# EAGLE schematic uc3906 charger 2 (EAGLE 6.4)
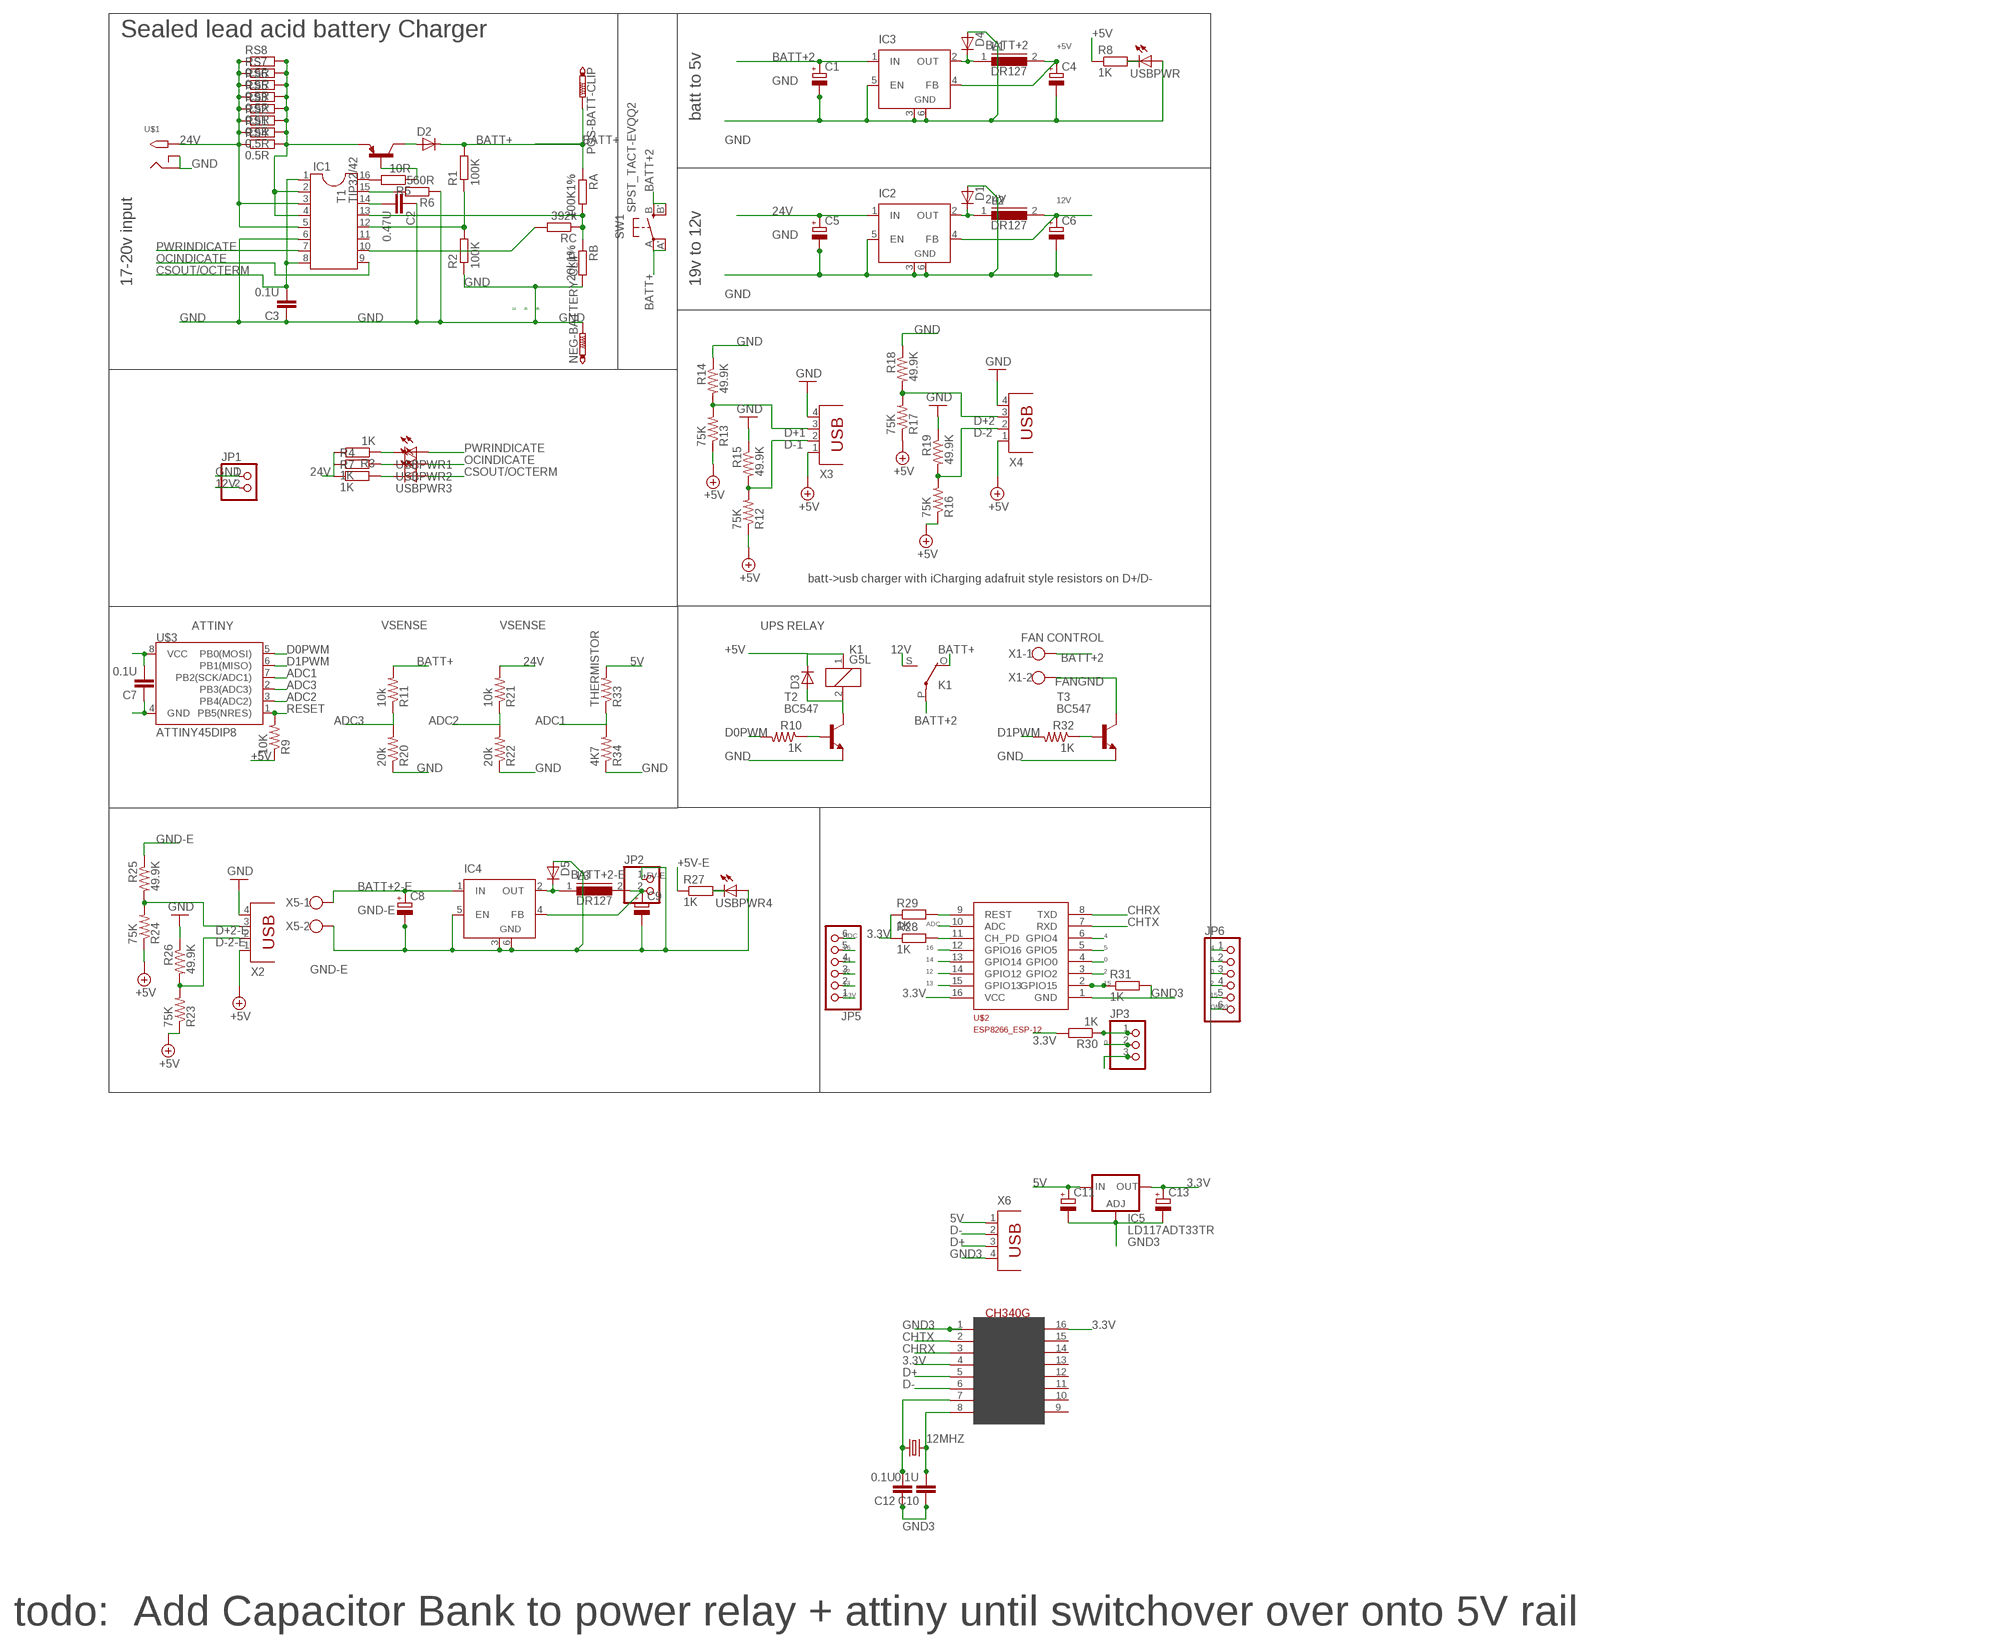
[diagram p0: schematic, sheet 1]

## Parts
12MHZ  CRYSTALHC49UP  [HC49UP]
C1  CPOL-EUE  [PANASONIC_E]
C2  0.47U  C-EUC1206  [C1206]
C3  0.1U  C-EUC1206  [C1206]
C4  CPOL-EUE  [PANASONIC_E]
C5  CPOL-EUE  [PANASONIC_E]
C6  CPOL-EUE  [PANASONIC_E]
C7  0.1U  C-EUC1206  [C1206]
C8  CPOL-EUE  [PANASONIC_E]
C9  CPOL-EUE  [PANASONIC_E]
C10  0.1U  C-EUC1206  [C1206]
C11  CPOL-EUE2.5-7  [E2,5-7]
C12  0.1U  C-EUC1206  [C1206]
C13  CPOL-EUE2.5-7  [E2,5-7]
D1  D-SOD-87  [SOD87]
D2  D-MLL-41  [MELF-MLL41]
D3  D-MLL-41  [MELF-MLL41]
D4  D-SOD-87  [SOD87]
D5  D-SOD-87  [SOD87]
IC1  DIL16  [DIL16]
IC2  LM2596S  [TO263-5]
IC3  LM2596S  [TO263-5]
IC4  LM2596S  [TO263-5]
IC5  LD117ADT33TR  [DPACK]
JP1  PINHD-1X2  [1X02]
JP2  PINHD-1X2  [1X02]
JP3  PINHD-1X3  [1X03]
JP5  PINHD-1X6  [1X06]
JP6  PINHD-1X6  [1X06]
K1  G5L  [G5LE]
L1  DR127  [DR127]
L2  DR127  [DR127]
L3  DR127  [DR127]
NEG-BATTERY-CLIP  PTR1PAD1-20Y  [P1-20Y]
POS-BATT-CLIP  PTR1PAD1-20Y  [P1-20Y]
R1  100K  R-EU_M1206  [M1206]
R2  100K  R-EU_M1206  [M1206]
R3  1K  R-EU_M1206  [M1206]
R4  1K  R-EU_M1206  [M1206]
R5  10R  R-EU_M1206  [M1206]
R6  560R  R-EU_M1206  [M1206]
R7  1K  R-EU_M1206  [M1206]
R8  1K  R-EU_M1206  [M1206]
R9  10K  R-US_M1206  [M1206]
R10  1K  R-US_M1206  [M1206]
R11  10k  R-US_M1206  [M1206]
R12  75K  R-US_M1206  [M1206]
R13  75K  R-US_M1206  [M1206]
R14  49.9K  R-US_M1206  [M1206]
R15  49.9K  R-US_M1206  [M1206]
R16  75K  R-US_M1206  [M1206]
R17  75K  R-US_M1206  [M1206]
R18  49.9K  R-US_M1206  [M1206]
R19  49.9K  R-US_M1206  [M1206]
R20  20k  R-US_M1206  [M1206]
R21  10k  R-US_M1206  [M1206]
R22  20k  R-US_M1206  [M1206]
R23  75K  R-US_M1206  [M1206]
R24  75K  R-US_M1206  [M1206]
R25  49.9K  R-US_M1206  [M1206]
R26  49.9K  R-US_M1206  [M1206]
R27  1K  R-EU_M1206  [M1206]
R28  1K  R-EU_M1206  [M1206]
R29  1K  R-EU_M1206  [M1206]
R30  1K  R-EU_M1206  [M1206]
R31  1K  R-EU_M1206  [M1206]
R32  1K  R-US_M1206  [M1206]
R33  THERMISTOR  R-US_M1206  [M1206]
R34  4K7  R-US_M1206  [M1206]
RA  100K1%  R-EU_M1206  [M1206]
RB  20k1%  R-EU_M1206  [M1206]
RC  392k  R-EU_M1206  [M1206]
RS1  0.5R  R-EU_R2512  [R2512]
RS2  0.5R  R-EU_R2512  [R2512]
RS3  0.5R  R-EU_R2512  [R2512]
RS4  0.5R  R-EU_R2512  [R2512]
RS5  0.5R  R-EU_R2512  [R2512]
RS6  0.5R  R-EU_R2512  [R2512]
RS7  0.5R  R-EU_R2512  [R2512]
RS8  0.5R  R-EU_R2512  [R2512]
SW1  SPST_TACT-EVQQ2  [EVQ-Q2]
T1  TIP32/42  TIP32C  [TO220]
T2  BC547  [TO92]
T3  BC547  [TO92]
U$1  2.1MMJACKTHM  [PJ-102A]
U$2  ESP8266_ESP-12  [ESP8266-ESP12]
U$3  ATTINY45DIP8  [DIP08]
U$4  CH340G  [SOIC16]
USBPWR  LED3MM  [LED3MM]
USBPWR1  LEDCHIPLED_1206  [CHIPLED_1206]
USBPWR2  LEDCHIPLED_1206  [CHIPLED_1206]
USBPWR3  LEDCHIPLED_1206  [CHIPLED_1206]
USBPWR4  LED3MM  [LED3MM]
X1  W237-102  [W237-102]
X2  PN87520  [PN87520]
X3  PN87520  [PN87520]
X4  PN87520  [PN87520]
X5  W237-102  [W237-102]
X6  PN61729  [PN61729]

## Nets
0: JP3.2 JP6.3 U$2.4(GPIO0)
2: JP6.4 U$2.3(GPIO2)
3.3V: C13.+ IC5.4(OUT) JP5.1 R28.1 R29.1 R30.2 U$2.16(VCC) U$4.4(V3) U$4.16(VCC)
4: JP6.1 U$2.6(GPIO4)
5: JP6.2 U$2.5(GPIO5)
5V: C11.+ IC5.3(IN) R33.2 X6.1
12: JP5.3 U$2.14(GPIO12)
12V [power]: C6.+ IC2.4(FB) JP1.2 K1.S(2:S) L2.2
13: JP5.2 U$2.15(GPIO13)
14: JP5.4 U$2.13(GPIO14)
15: JP6.5 R31.1 U$2.2(GPIO15)
16: JP5.5 U$2.12(GPIO16)
24V: C5.+ IC1.3 IC1.5 IC2.1(IN) R3.2 R4.1 R7.1 R21.2 RS1.1 RS2.1 RS3.1 RS4.1 RS5.1 RS6.1 RS7.1 RS8.1 U$1.TIP
+5V [power]: C4.+ C7.2 D3.1(C) IC3.4(FB) K1.1 L1.2 R8.1 R9.1 R12.1 R13.1 R16.1 R17.1 U$3.8(VCC) X3.1 X4.1
+5V-E [power]: C9.+ IC4.4(FB) JP2.2 L3.2 R23.1 R24.1 R27.1 X2.1 ; supply symbol labelled +5V
ADC: JP5.6 U$2.10(ADC)
ADC1: R33.1 R34.2 U$3.7(PB2(SCK/ADC1))
ADC2: R21.1 R22.2 U$3.3(PB4(ADC2))
ADC3: R11.1 R20.2 U$3.2(PB3(ADC3))
BATT+: D2.1(C) K1.O(2:O) POS-BATT-CLIP.TP R1.2 R11.2 RA.1 SW1.A'(P1) SW1.A(P)
BATT+2: C1.+ IC3.1(IN) K1.P(2:P) SW1.B'(S1) SW1.B(S) X1.1
BATT+2-E: C8.+ IC4.1(IN) X5.1
CHARGEENABLE: IC1.12 R1.1 R2.2
CHRX: U$2.8(TXD) U$4.3(RX)
CHTX: U$2.7(RXD) U$4.2(TX)
COMPENSATION: C2.2 IC1.14
CSOUT/OCTERM: C3.2 IC1.1 IC1.8 USBPWR3.A
D0PWM: R10.2 U$3.5(PB0(MOSI))
D1PWM: R32.2 U$3.6(PB1(MISO))
D+: U$4.5(D+) X6.3
D+1: R13.2 R14.2 X3.3
D+2: R17.2 R18.2 X4.3
D+2-E: R24.2 R25.2 X2.3
D-: U$4.6(D-) X6.2
D-1: R12.2 R15.2 X3.2
D-2: R16.2 R19.2 X4.2
D-2-E: R23.2 R26.2 X2.2
DRIVERSINK: IC1.16 R5.2
DRIVERSOURCE: IC1.15 R6.2
FANGND: T3.3(C) X1.2
GND: C1.- C2.1 C3.1 C4.- C5.- C6.- C7.1 D1.2(A) D4.2(A) IC1.6 IC2.3(GND) IC2.5(EN) IC2.6(GND) IC3.3(GND) IC3.5(EN) IC3.6(GND) JP1.1 NEG-BATTERY-CLIP.TP R2.1 R6.1 R14.1 R15.1 R18.1 R19.1 R20.1 R22.1 R34.1 RB.2 T2.1(E) T3.1(E) U$1.RING U$1.RING_SW U$3.4(GND) USBPWR.A X3.4 X4.4
GND3: C10.1 C11.- C12.1 C13.- IC5.1(ADJ) JP3.3 JP6.6 R31.2 U$2.1(GND) U$4.1(GND) X6.4
GND-E: C8.- C9.- D5.2(A) IC4.3(GND) IC4.5(EN) IC4.6(GND) JP2.1 R25.1 R26.1 USBPWR4.A X2.4 X5.2 ; supply symbol labelled GND
IOUT: IC1.2 IC1.4 RS1.2 RS2.2 RS3.2 RS4.2 RS5.2 RS6.2 RS7.2 RS8.2 T1.3(E)
N$2: R3.1 USBPWR1.C
N$3: D1.1(C) IC2.2(OUT) L2.1
N$4: D4.1(C) IC3.2(OUT) L1.1
N$5: R4.2 USBPWR2.C
N$6: R7.2 USBPWR3.C
N$7: R8.2 USBPWR.K(C)
N$8: D3.2(A) K1.2 T2.3(C)
N$9: D5.1(C) IC4.2(OUT) L3.1
N$10: R10.1 T2.2(B)
N$11: R27.2 USBPWR4.K(C)
N$12: 12MHZ.1 C12.2 U$4.7(XI)
N$13: 12MHZ.2 C10.2 U$4.8(XO)
N$14: R5.1 T1.1(B)
N$15: D2.2(A) T1.2(C)
N$16: R29.2 U$2.9(REST)
N$18: R28.2 U$2.11(CH_PD)
N$21: JP3.1 R30.1
N$36: R32.1 T3.2(B)
OCINDICATE: IC1.9 USBPWR2.A
PWRINDICATE: IC1.7 USBPWR1.A
RESET: R9.2 U$3.1(PB5(NRES))
STATELEVELCONTROL: IC1.10 RC.2
VSENSE: IC1.13 RA.2 RB.1 RC.1
Unconnected: IC1.11 U$4.9(CTS) U$4.10(DSR) U$4.11(RI) U$4.12(DCD) U$4.13(DTR) U$4.14(RTS) U$4.15(RS232)

## Notes on the sheet
- Sealed lead acid battery Charger
- batt to 5v
- 17-20v input | 19v to 12v
- J4 | J5 | J6
- batt->usb charger with iCharging adafruit style resistors on D+/D-
- ATTINY | UPS RELAY
- VSENSE | VSENSE | FAN CONTROL
- todo:  Add Capacitor Bank to power relay + attiny until switchover over onto 5V rail

## Library data of the parts
12MHZ = crystal:CRYSTAL: CRYSTAL; OC_FARNELL: unknown; OC_NEWARK: unknown
C1 C4-C6 C8 C9 = resistor:CPOL-EU: POLARIZED CAPACITOR, European symbol
C2 C3 C7 C10 C12 = rcl:C-EU: CAPACITOR, European symbol
C11 C13 = rcl:CPOL-EU: POLARIZED CAPACITOR, European symbol
D1-D5 = semicon-smd-ipc:D-: DIODE unfilled
IC1 = ic-package:DIL16: Dual In Line / Socket
IC2-IC4 = linear:LM2596S: STEP-DOWN VOLTAGE REGULATOR
IC5 = v-reg:LD117A?*: Low drop fixed and adjustable positive voltage regulators 1 A Source: http://www.st.com/stonline/products/literature/ds/7194/ld1117axx.pdf
JP1 JP2 = pinhead:PINHD-1X2: PIN HEADER
JP3 = pinhead:PINHD-1X3: PIN HEADER
JP5 JP6 = pinhead:PINHD-1X6: PIN HEADER
K1 = relay:G5L: RELAY 1 x switch, 10 A/120 V AC, 8 A/30 V ADC, Omron; OC_FARNELL: unknown; OC_NEWARK: unknown
L1-L3 = inductors:DR127: High Power Density, High Efficiency, Shielded Inductors Source: coiltronics_dr_series.pdf
NEG-BATTERY-CLIP POS-BATT-CLIP = testpad:PTR1: TEST PIN
R1-R8 R27-R31 RA RB RC = rcl:R-EU_: RESISTOR, European symbol
R9-R26 R32-R34 = adafruit:R-US_: RESISTOR, American symbol
RS1-RS8 = resistor:R-EU_: RESISTOR, European symbol
SW1 = adafruit:SPST_TACT: SMT 6mm switch, EVQQ2 series http://www.ladyada.net/library/eagle
T1 = transistor:TIP32: PNP Transistor Medium Power Linear Switching Applications Source: http://onsemi.com
T2 T3 = transistor:BC547: NPN TRANSISTOR
U$1 = adafruit:2.1MMJACK: 2.1mm x 5.5mm THM DC jack with internal switch. Digikey part #PJ-102A, 4UCON part #05537 2.1mm x 5.5mm SMT DC jack with internal switch. Digikey part #PJ-002A-SMT, 4UCON part #03267 By microbuilder.eu & adafruit.com
U$2 = ESP8266-ESP12:ESP8266_ESP-12: ESP8266 ESP-12 Discussion about pins here: http://www.esp8266.com/viewtopic.php?f=13&t=1429
U$3 = SparkFun:ATTINY45: Atmel ATTiny45
U$4 = usb-serial:CH340G
USBPWR USBPWR1-USBPWR4 = RepRapjr:LED: LED OSRAM: - CHIPLED LG R971, LG N971, LY N971, LG Q971, LY Q971, LO R971, LY R971 LH N974, LH R974 LS Q976, LO Q976, LY Q976 LO Q996 - Hyper CHIPLED LW Q18S LB Q993, LB Q99A, LB R99A - SideLED LS A670, LO A670, LY A670, LG A670, LP A670 LB A673, LV A673, LT A673, LW A673 LH A674 LY A675 LS A676, LA A676, LO A676, LY A676, LW A676 LS A679, LY A679, LG A679 - Hyper Micro SIDELED® LS Y876, LA Y876, LO Y876, LY Y876 LT Y87S - SmartLED LW L88C, LW L88S LB L89C, LB L89S, LG L890 LS L89K, LO L89K, LY L89K LS L896, LA L896, LO L896, LY L896 - TOPLED LS T670, LO T670, LY T670, LG T670, LP T670 LSG T670, LSP T670, LSY T670, LOP T670, LYG T670 LG T671, LOG T671, LSG T671 LB T673, LV T673, LT T673, LW T673 LH T674 LS T676, LA T676, LO T676, LY T676, LB T676, LH T676, LSB T676, LW T676 LB T67C, LV T67C, LT T67C, LS T67K, LO T67K, LY T67K, LW E67C LS E67B, LA E67B, LO E67B, LY E67B, LB E67C, LV E67C, LT E67C LW T67C LS T679, LY T679, LG T679 LS T770, LO T770, LY T770, LG T770, LP T770 LB T773, LV T773, LT T773, LW T773 LH T774 LS E675, LA E675, LY E675, LS T675 LS T776, LA T776, LO T776, LY T776, LB T776 LHGB T686 LT T68C, LB T68C - Hyper Mini TOPLED® LB M676 - Mini TOPLED Santana® LG M470 LS M47K, LO M47K, LY M47K Source: http://www.osram.convergy.de LUXEON: - LUMILED® LXK2-PW12-R00, LXK2-PW12-S00, LXK2-PW14-U00, LXK2-PW14-V00 LXK2-PM12-R00, LXK2-PM12-S00, LXK2-PM14-U00 LXK2-PE12-Q00, LXK2-PE12-R00, LXK2-PE12-S00, LXK2-PE14-T00, LXK2-PE14-U00 LXK2-PB12-K00, LXK2-PB12-L00, LXK2-PB12-M00, LXK2-PB14-N00, LXK2-PB14-P00, LXK2-PB14-Q00 LXK2-PR12-L00, LXK2-PR12-M00, LXK2-PR14-Q00, LXK2-PR14-R00 LXK2-PD12-Q00, LXK2-PD12-R00, LXK2-PD12-S00 LXK2-PH12-R00, LXK2-PH12-S00 LXK2-PL12-P00, LXK2-PL12-Q00, LXK2-PL12-R00 Source: www.luxeon.com KINGBRIGHT: KA-3528ASYC Source: www.kingbright.com
X1 X5 = con-wago-500:W237-102: WAGO SCREW CLAMP; MPN: 237-102; OC_FARNELL: unknown; OC_NEWARK: 70K9898
X2-X4 = con-berg:PN87520: BERG USB connector; OC_FARNELL: unknown; OC_NEWARK: unknown
X6 = con-berg:PN61729: BERG USB connector; OC_FARNELL: unknown; OC_NEWARK: unknown

## Net classes
1 power: width 0.6 mm, clearance 0.305 mm